# EAGLE design untitled (EAGLE 5.11)
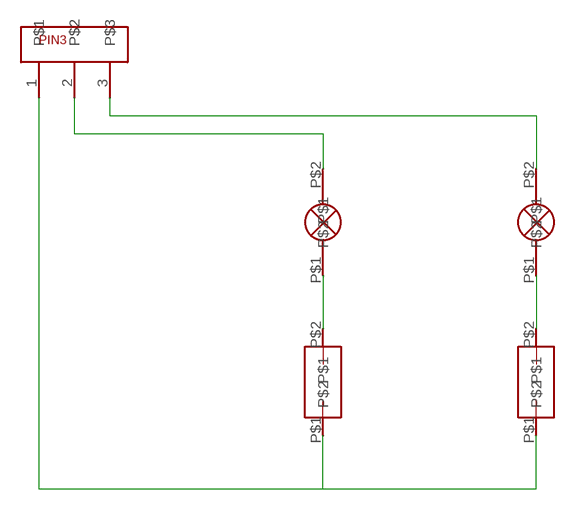
[diagram p0: schematic, sheet 1]

## Parts
U$1  PIN3  [PIN3]
U$2  NEON_LUMP  [NEON_LUMP]
U$3  NEON_LUMP  [NEON_LUMP]
U$4  REGISTER  [REGISTER]
U$5  REGISTER  [REGISTER]

## Nets
N$1: U$2.P$1 U$4.P$2
N$2: U$3.P$1 U$5.P$2
N$3: U$1.3 U$3.P$2
N$4: U$1.2 U$2.P$2
N$5: U$1.1 U$4.P$1 U$5.P$1

## Library data of the parts
U$1 = mylib:PIN3
U$2 U$3 = mylib:NEON_LUMP
U$4 U$5 = mylib:REGISTER

## Board
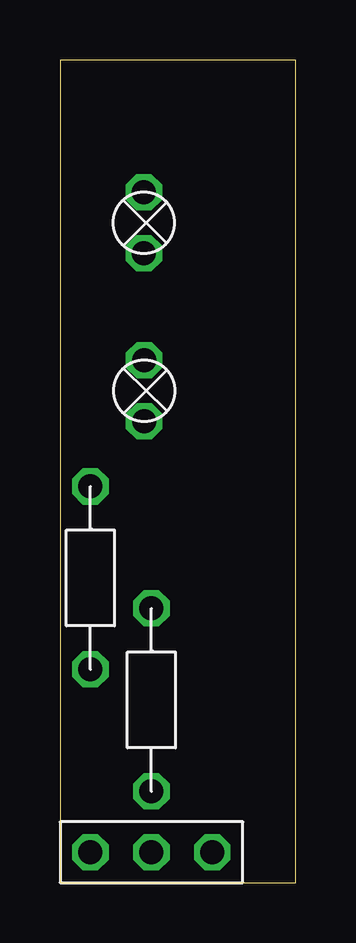
[diagram p1: board, top side]
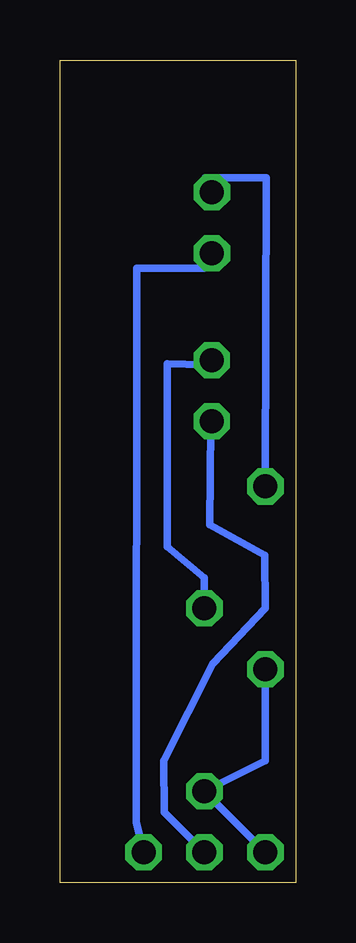
[diagram p2: board, bottom side, seen from below]

Size 9.83 x 34.28 mm. Coordinates in mm from the lower left corner, seen from the top.
Outline: 0,0 9.83,0 9.83,34.28 0,34.28 0,0
Copper layers (1*16): Top 0.035mm / dielectric 1.5mm / Bottom 0.035mm
Design rules "default": minimum track width 10mil, minimum drill 24mil, track to track 8mil, track to pad 8mil, pad to pad 8mil, via to via 8mil, smd to smd 8mil, copper to edge 40mil, drill to drill 8mil, minimum pad ring 10mil, minimum via ring 8mil, stop-mask expansion 4mil, vias tented up to drill 0mil, thermal gap 10mil

### Footprints (pad centres in the part's own frame; a part is rotated, then mirrored left to right if it is on the bottom)
PIN3 = drill 1 octagon: 1 -2.54,0; 2 0,0; 3 2.54,0
NEON_LUMP = drill 1 octagon: P$1 1.27,0; P$2 -1.27,0
REGISTER = drill 1 octagon: P$1 -3.81,0; P$2 3.81,0

### Placement (x,y rotation side)
U$1  3.81,1.27 0 top
U$2  3.5,20.5 90 top
U$3  3.5,27.5 90 top
U$4  3.81,7.62 90 top
U$5  1.27,12.7 90 top

### Tracks (layer width: path | path; a pad name or v marks a point on that pad's centre or on a via)
N$1
  Bottom 0.305: U$4.P$2 3.81,12.7 5.37,14.01 5.37,21.63 3.81,21.59 U$2.P$1
N$2
  Bottom 0.305: U$5.P$2 1.24,29.38 3.78,29.38 U$3.P$1
N$3
  Bottom 0.305: U$1.3 6.66,2.52 6.64,25.6 3.81,25.6 U$3.P$2
N$4
  Bottom 0.305: U$1.2 5.48,2.94 5.51,5.08 3.46,9.13 1.27,11.43 1.31,13.64 3.59,14.91 3.55,19.05 3.81,19.05 U$2.P$2
N$5
  Bottom 0.305: U$1.1 U$4.P$1 1.27,5.08 U$5.P$1